# EAGLE design Blue_Pill_Base_Shield (EAGLE 9.1.3)
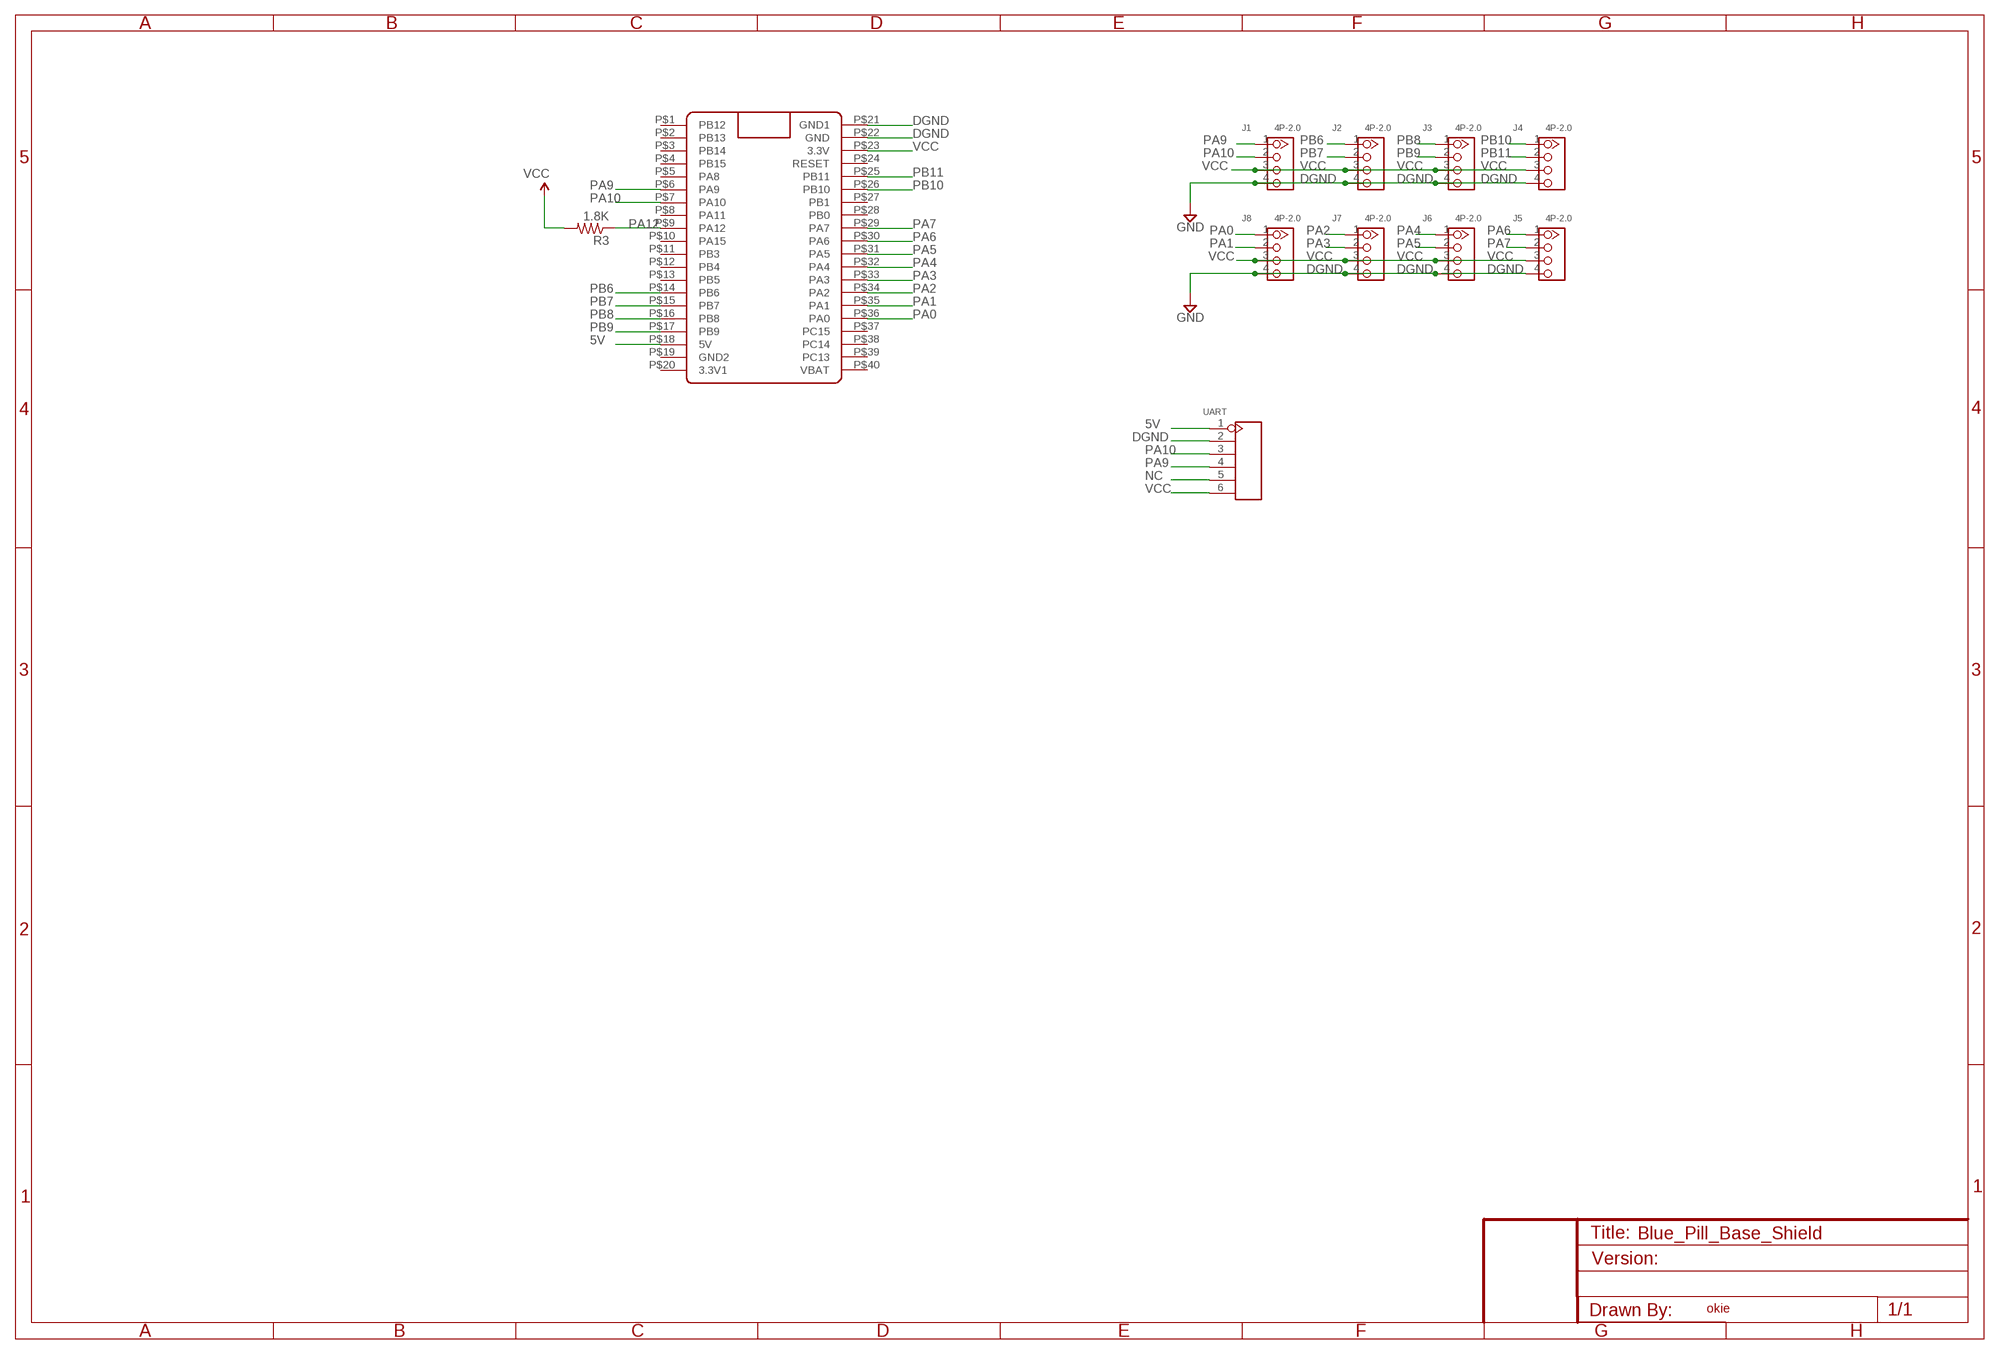
[diagram p0: schematic, sheet 1]

## Parts
J1  4P-2.0  GROVE-CONNECTOR-DIP(4P-2.0)  [HW4-2.0]
J2  4P-2.0  GROVE-CONNECTOR-DIP(4P-2.0)  [HW4-2.0]
J3  4P-2.0  GROVE-CONNECTOR-DIP(4P-2.0)  [HW4-2.0]
J4  4P-2.0  GROVE-CONNECTOR-DIP(4P-2.0)  [HW4-2.0]
J5  4P-2.0  GROVE-CONNECTOR-DIP(4P-2.0)  [HW4-2.0]
J6  4P-2.0  GROVE-CONNECTOR-DIP(4P-2.0)  [HW4-2.0]
J7  4P-2.0  GROVE-CONNECTOR-DIP(4P-2.0)  [HW4-2.0]
J8  4P-2.0  GROVE-CONNECTOR-DIP(4P-2.0)  [HW4-2.0]
R3  1.8K  RESISTOR0603  [0603]
U$5  BLUE_PILL  [BLUE_PILL]
UART  YELLOW-6P-2.54  DIP-YELLOW-FEMALE-HEADER-VERT(6P-2.54)  [H6-2.54]

## Nets
5V: U$5.P$18(5V) UART.1
DGND: J1.4 J2.4 J3.4 J4.4 J5.4 J6.4 J7.4 J8.4 U$5.P$21(GND1) U$5.P$22(GND) UART.2 ; supply symbol labelled GND
NC: UART.5
PA0: J8.1 U$5.P$36(PA0)
PA1: J8.2 U$5.P$35(PA1)
PA2: J7.1 U$5.P$34(PA2)
PA3: J7.2 U$5.P$33(PA3)
PA4: J6.1 U$5.P$32(PA4)
PA5: J6.2 U$5.P$31(PA5)
PA6: J5.1 U$5.P$30(PA6)
PA7: J5.2 U$5.P$29(PA7)
PA9: J1.1 U$5.P$6(PA9) UART.4
PA10: J1.2 U$5.P$7(PA10) UART.3
PA12: R3.1 U$5.P$9(PA12)
PB6: J2.1 U$5.P$14(PB6)
PB7: J2.2 U$5.P$15(PB7)
PB8: J3.1 U$5.P$16(PB8)
PB9: J3.2 U$5.P$17(PB9)
PB10: J4.1 U$5.P$26(PB10)
PB11: J4.2 U$5.P$25(PB11)
VCC: J1.3 J2.3 J3.3 J4.3 J5.3 J6.3 J7.3 J8.3 R3.2 U$5.P$23(3.3V) UART.6
Unconnected: U$5.P$1(PB12) U$5.P$2(PB13) U$5.P$3(PB14) U$5.P$4(PB15) U$5.P$5(PA8) U$5.P$8(PA11) U$5.P$10(PA15) U$5.P$11(PB3) U$5.P$12(PB4) U$5.P$13(PB5) U$5.P$19(GND2) U$5.P$20(3.3V1) U$5.P$24(RESET) U$5.P$27(PB1) U$5.P$28(PB0) U$5.P$37(PC15) U$5.P$38(PC14) U$5.P$39(PC13) U$5.P$40(VBAT)

## Notes on the sheet
- okie

## Library data of the parts
J1-J8 = Seeed-Connector:GROVE-CONNECTOR-DIP(4P-2.0): 320110033
R3 = SparkFun:RESISTOR: Resistor Basic schematic elements and footprints for 0603, 1206, and PTH 1/10th watt (small) resistors.
U$5 = BluePill:BLUE_PILL
UART = Seeed-Connector:DIP-YELLOW-FEMALE-HEADER-VERT(6P-2.54): 320030019; MPN: F185-1106A1BSYA3

## Net classes
1 vcc: width 0.254 mm

## Board
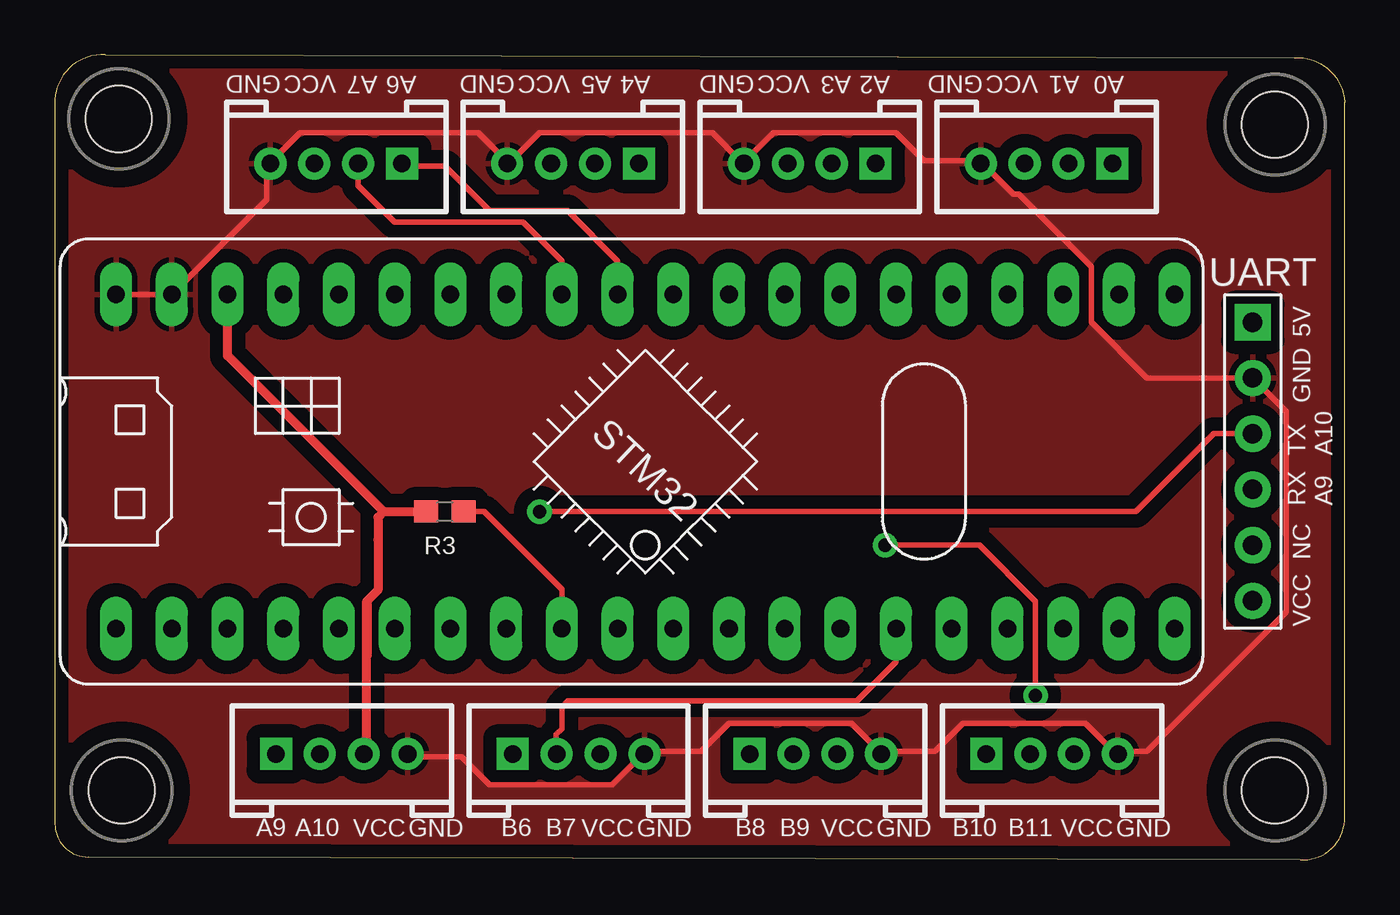
[diagram p1: board, top side]
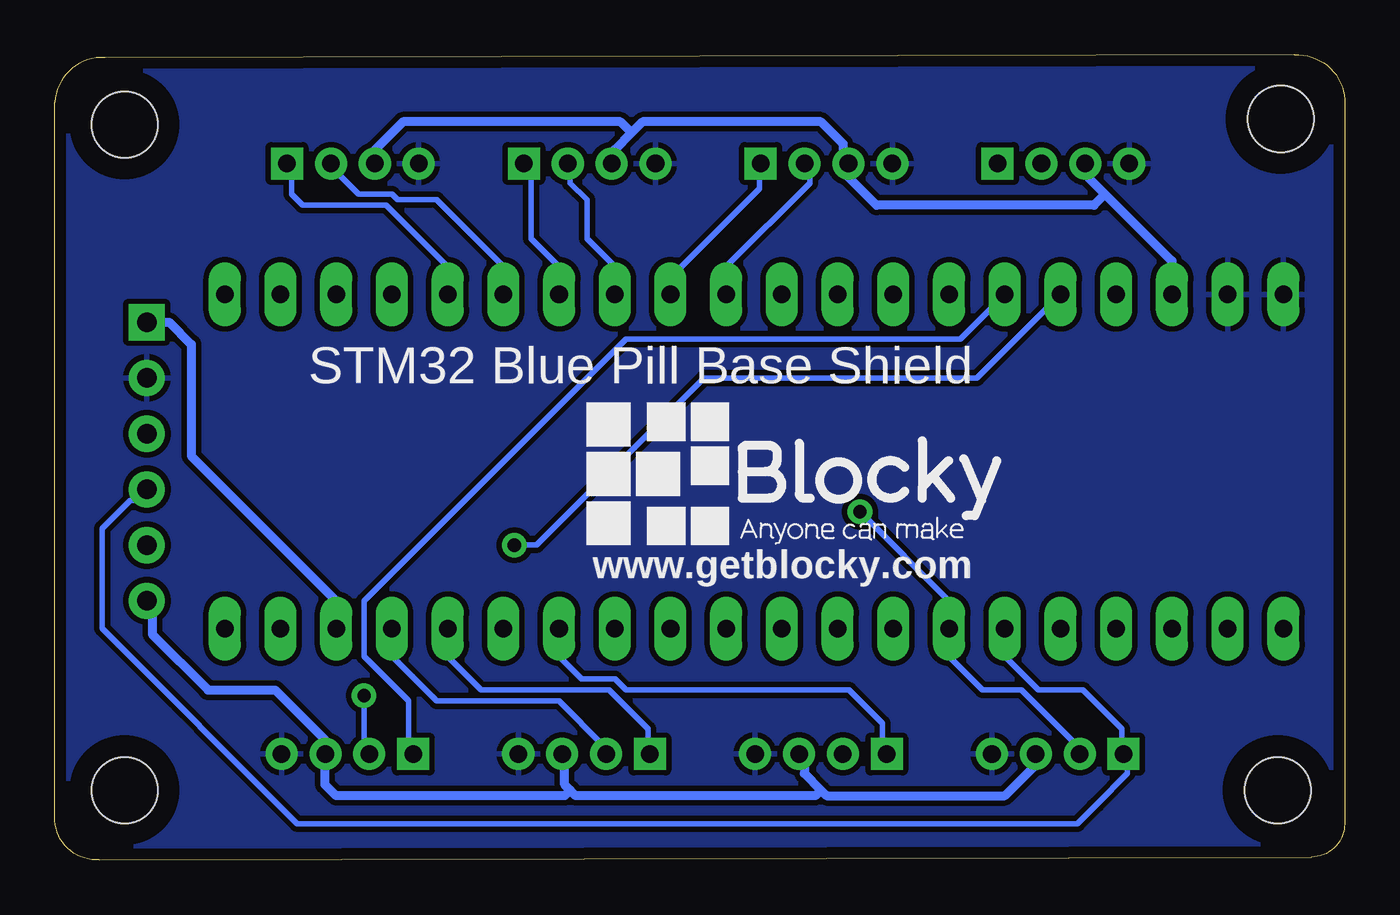
[diagram p2: board, bottom side, seen from below]

Size 58.8 x 36.71 mm. Coordinates in mm from the lower left corner, seen from the top.
Outline: 2.29,36.71 56.52,36.58 arc-90 58.8,34.55 58.8,1.78 arc-90 56.77,0 1.52,0.13 arc-90 0,1.65 0,34.67 arc-90 2.29,36.71
Copper layers (1*16): Top 0.035mm / dielectric 1.5mm / Bottom 0.035mm
Design rules "KhaThanh *": minimum track width 10mil, minimum drill 24mil, track to track 10mil, track to pad 16mil, pad to pad 10mil, via to via 10mil, smd to smd 8mil, copper to edge 20mil, drill to drill 12mil, minimum pad ring 13mil, minimum via ring 10mil, stop-mask expansion 4mil, vias tented up to drill 25mil, thermal gap 10mil

### Footprints (pad centres in the part's own frame; a part is rotated, then mirrored left to right if it is on the bottom)
HW4-2.0 = drill 0.8 pad 1.27 square: 1 -3,0 | drill 0.8 pad 1.27: 2 -1,0; 3 1,0; 4 3,0
0603 = smd 1.1 x 1: 1 -0.85,0; 2 0.85,0
KFH-M3 = hole 3: 0,0
BLUE_PILL = drill 0.8 long: P$1 -7.62,15.24; P$2 -7.62,12.7; P$3 -7.62,10.16; P$4 -7.62,7.62; P$5 -7.62,5.08; P$6 -7.62,2.54; P$7 -7.62,0; P$8 -7.62,-2.54; P$9 -7.62,-5.08; P$10 -7.62,-7.62; P$11 -7.62,-10.16; P$12 -7.62,-12.7; P$13 -7.62,-15.24; P$14 -7.62,-17.78; P$15 -7.62,-20.32; P$16 -7.62,-22.86; P$17 -7.62,-25.4; P$18 -7.62,-27.94; P$19 -7.62,-30.48; P$20 -7.62,-33.02; P$21 7.62,15.24; P$22 7.62,12.7; P$23 7.62,10.16; P$24 7.62,7.62; P$25 7.62,5.08; P$26 7.62,2.54; P$27 7.62,0; P$28 7.62,-2.54; P$29 7.62,-5.08; P$30 7.62,-7.62; P$31 7.62,-10.16; P$32 7.62,-12.7; P$33 7.62,-15.24; P$34 7.62,-17.78; P$35 7.62,-20.32; P$36 7.62,-22.86; P$37 7.62,-25.4; P$38 7.62,-27.94; P$39 7.62,-30.48; P$40 7.62,-33.02
H6-2.54 = drill 0.889 pad 1.651 square: 1 0,6.35 | drill 0.889 pad 1.651: 2 0,3.81; 3 0,1.27; 4 0,-1.27; 5 0,-3.81; 6 0,-6.35

### Placement (x,y rotation side)
J1  13.08,4.83 0 top
J2  23.88,4.83 0 top
J3  34.67,4.83 0 top
J4  45.47,4.83 0 top
J5  12.83,31.75 180 top
J6  23.62,31.75 180 top
J7  34.42,31.75 180 top
J8  45.21,31.75 180 top
R3  17.78,15.88 180 top
U$1  [KFH-M3]  2.92,33.79 0 top
U$2  [KFH-M3]  3.05,3.18 0 top
U$3  [KFH-M3]  55.63,33.53 0 top
U$4  [KFH-M3]  55.63,3.18 0 top
U$5  18.03,18.16 90 top
U$6  [BLOCKY_LOGO]  35.56,14.1 0 bottom
UART  54.61,18.16 0 top

### Tracks (layer width: path | path; a pad name or v marks a point on that pad's centre or on a via)
5V
  Bottom 0.406: U$5.P$18 45.97,11.81 52.58,18.42 52.58,23.5 53.59,24.51 UART.1
DGND
  Top 0.254: J1.4 16.26,4.7 18.54,4.7 19.81,3.43 25.4,3.43 26.67,4.7 J2.4 26.92,4.96 29.46,4.96 30.73,6.23 36.32,6.23 37.59,4.96 J3.4 37.85,4.96 40.13,4.96 41.4,6.23 46.99,6.23 48.26,4.96 J4.4 48.51,4.96 49.78,4.96 56.13,11.31 56.13,20.45 UART.2 49.78,21.97 47.24,24.51 47.24,27.05 43.94,30.36 43.69,30.36 42.42,31.63 J8.4 42.16,31.88 39.62,31.88 38.35,33.15 32.77,33.15 31.5,31.88 J7.4 31.24,31.88 29.97,33.15 22.1,33.15 20.83,31.88 J6.4 20.57,31.88 19.3,33.15 11.18,33.15 9.91,31.88 J5.4 9.65,31.63 9.65,30.1 U$5.P$22 U$5.P$21
  pour Bottom: 0,36.71 0,0.13 58.93,0.13 58.93,36.71
  pour Top (isolate 0.61): 0,0.13 0,36.71 58.93,36.71 58.93,0.13
PA0
  Bottom 0.254: U$5.P$36 40.89,27.05 43.69,29.85 47.5,29.85 48.01,30.36 48.01,31.63 J8.1
PA1
  Bottom 0.254: U$5.P$35 38.35,27.05 41.4,30.1 43.18,30.1 43.43,30.36 44.96,30.36 46.23,31.63 J8.2
PA2
  Bottom 0.254: U$5.P$34 35.81,27.05 37.08,28.32 37.08,31.37 37.34,31.63 J7.1
PA3
  Bottom 0.254: U$5.P$33 33.27,27.05 34.54,28.32 34.54,30.1 35.31,30.86 35.31,31.63 J7.2
PA4
  Bottom 0.254: U$5.P$32 30.73,26.55 26.67,30.61 26.67,31.63 J6.1
PA5
  Bottom 0.254: U$5.P$31 28.19,27.05 24.38,30.86 24.38,31.63 J6.2
PA6
  Top 0.254: U$5.P$30 25.65,27.31 23.37,29.59 19.81,29.59 17.78,31.63 16,31.63 J5.1
PA7
  Top 0.254: U$5.P$29 23.11,27.31 21.34,29.09 15.49,29.09 13.83,30.75 J5.2
PA9
  Bottom 0.254: U$5.P$6 15.49,9.27 13.97,7.75 11.94,7.75 10.16,5.97 10.16,4.96 J1.1 9.91,4.7 9.91,3.94 11.3,2.54 | UART.4 55.12,16.39 55.37,16.39 56.64,15.12 56.64,10.54 47.75,1.65 12.19,1.65 11.3,2.54 | 11.3,2.54 11.43,2.42
PA10  (via drill 0.61)
  Top 0.254: UART.3 52.83,19.43 49.28,15.88 v22.1,15.88
  Bottom 0.254: J1.2 12.19,4.96 12.19,5.21 14.73,7.75 16.51,7.75 18.03,9.27 U$5.P$7 18.03,11.81 v22.1,15.88
PA12
  Top 0.254: R3.1 18.8,15.88 19.56,15.88 23.11,12.32 U$5.P$9
PB6
  Bottom 0.254: U$5.P$14 35.81,9.27 34.8,8.26 33.27,8.26 32.77,7.75 22.61,7.75 21.08,6.23 21.08,4.96 J2.1
PB7
  Top 0.254: U$5.P$15 38.35,9.02 36.58,7.24 23.37,7.24 23.11,6.99 23.11,5.97 22.86,5.72 22.86,4.96 J2.2
PB8
  Bottom 0.254: U$5.P$16 40.89,9.27 39.37,7.75 33.53,7.75 31.75,5.97 31.75,4.96 J3.1
PB9
  Bottom 0.254: U$5.P$17 43.43,9.27 41.4,7.24 35.81,7.24 33.78,5.21 33.78,4.96 J3.2
PB10
  Bottom 0.254: U$5.P$26 17.53,23.75 32.77,23.75 44.7,11.81 44.7,9.27 42.67,7.24 42.67,4.96 J4.1
PB11  (via drill 0.61)
  Top 0.254: v37.85,14.35 42.14,14.35 44.7,11.79 v44.7,7.5
  Bottom 0.254: U$5.P$25 16.76,21.97 29.21,21.97 36.83,14.35 v37.85,14.35 | v44.7,7.5 44.7,5.07 J4.2
VCC
  Top 0.254: U$5.P$23 7.87,24.26 | 16.76,15.88 R3.2 | J1.3 14.08,5.32 14.22,5.46 | 14.22,11.79 14.23,11.8
  Top 0.406: 14.99,15.88 16.76,15.88 | 14.99,15.88 14.73,15.62 14.73,14.61 14.73,12.3 14.23,11.8 14.23,9.29 | 14.22,5.46 14.22,11.79 | U$5.P$23 7.87,22.99 14.99,15.88
  Bottom 0.254: 46.48,4.96 J4.3 | 14.22,4.19 14.22,4.7 J1.3 | 35.56,4.7 J3.3 | 11.68,31.63 J5.3 | 22.61,31.63 J6.3 | 33.27,31.88 J7.3 | 44.2,31.88 J8.3
  Bottom 0.406: 46.48,4.96 46.48,5.46 48.77,7.75 51.82,7.75 54.36,10.29 54.36,11.56 UART.6 | 14.22,4.19 15.49,2.92 23.62,2.92 23.88,3.18 | 23.88,3.18 24.64,3.94 24.64,4.7 J2.3 | 35.56,4.7 35.56,3.43 35.31,3.18 | 35.31,3.18 35.05,2.92 24.13,2.92 23.88,3.18 | 35.31,3.18 35.56,2.92 45.97,2.92 46.48,3.43 46.48,4.7 J4.3 | 11.68,31.63 11.68,31.12 10.92,30.36 | 7.87,27.05 U$5.P$23 7.87,27.31 10.92,30.36 | 22.61,31.63 22.61,31.12 21.34,29.85 11.43,29.85 10.92,30.36 | 33.27,31.88 33.27,32.39 32.51,33.15 | 32.51,33.15 32,33.66 23.88,33.66 22.86,32.64 22.86,31.88 J6.3 | 44.2,31.88 44.2,32.39 42.93,33.66 33.02,33.66 32.51,33.15

### Text on the board
_tsilk: GND | VCC | A7 | A6 | GND | VCC | A5 | A4 | GND | VCC | A3 | A2 | GND | VCC | A1 | A0 | 5V | GND | TX / A10 | RX / A9 | NC | VCC | A9 | A10 | VCC | GND | B6 | B7 | VCC | GND | B8 | B9 | VCC | GND | B10 | B11 | VCC | GND
_bsilk: STM32 Blue Pill Base Shield